# EAGLE design shield (EAGLE 6.6.0)
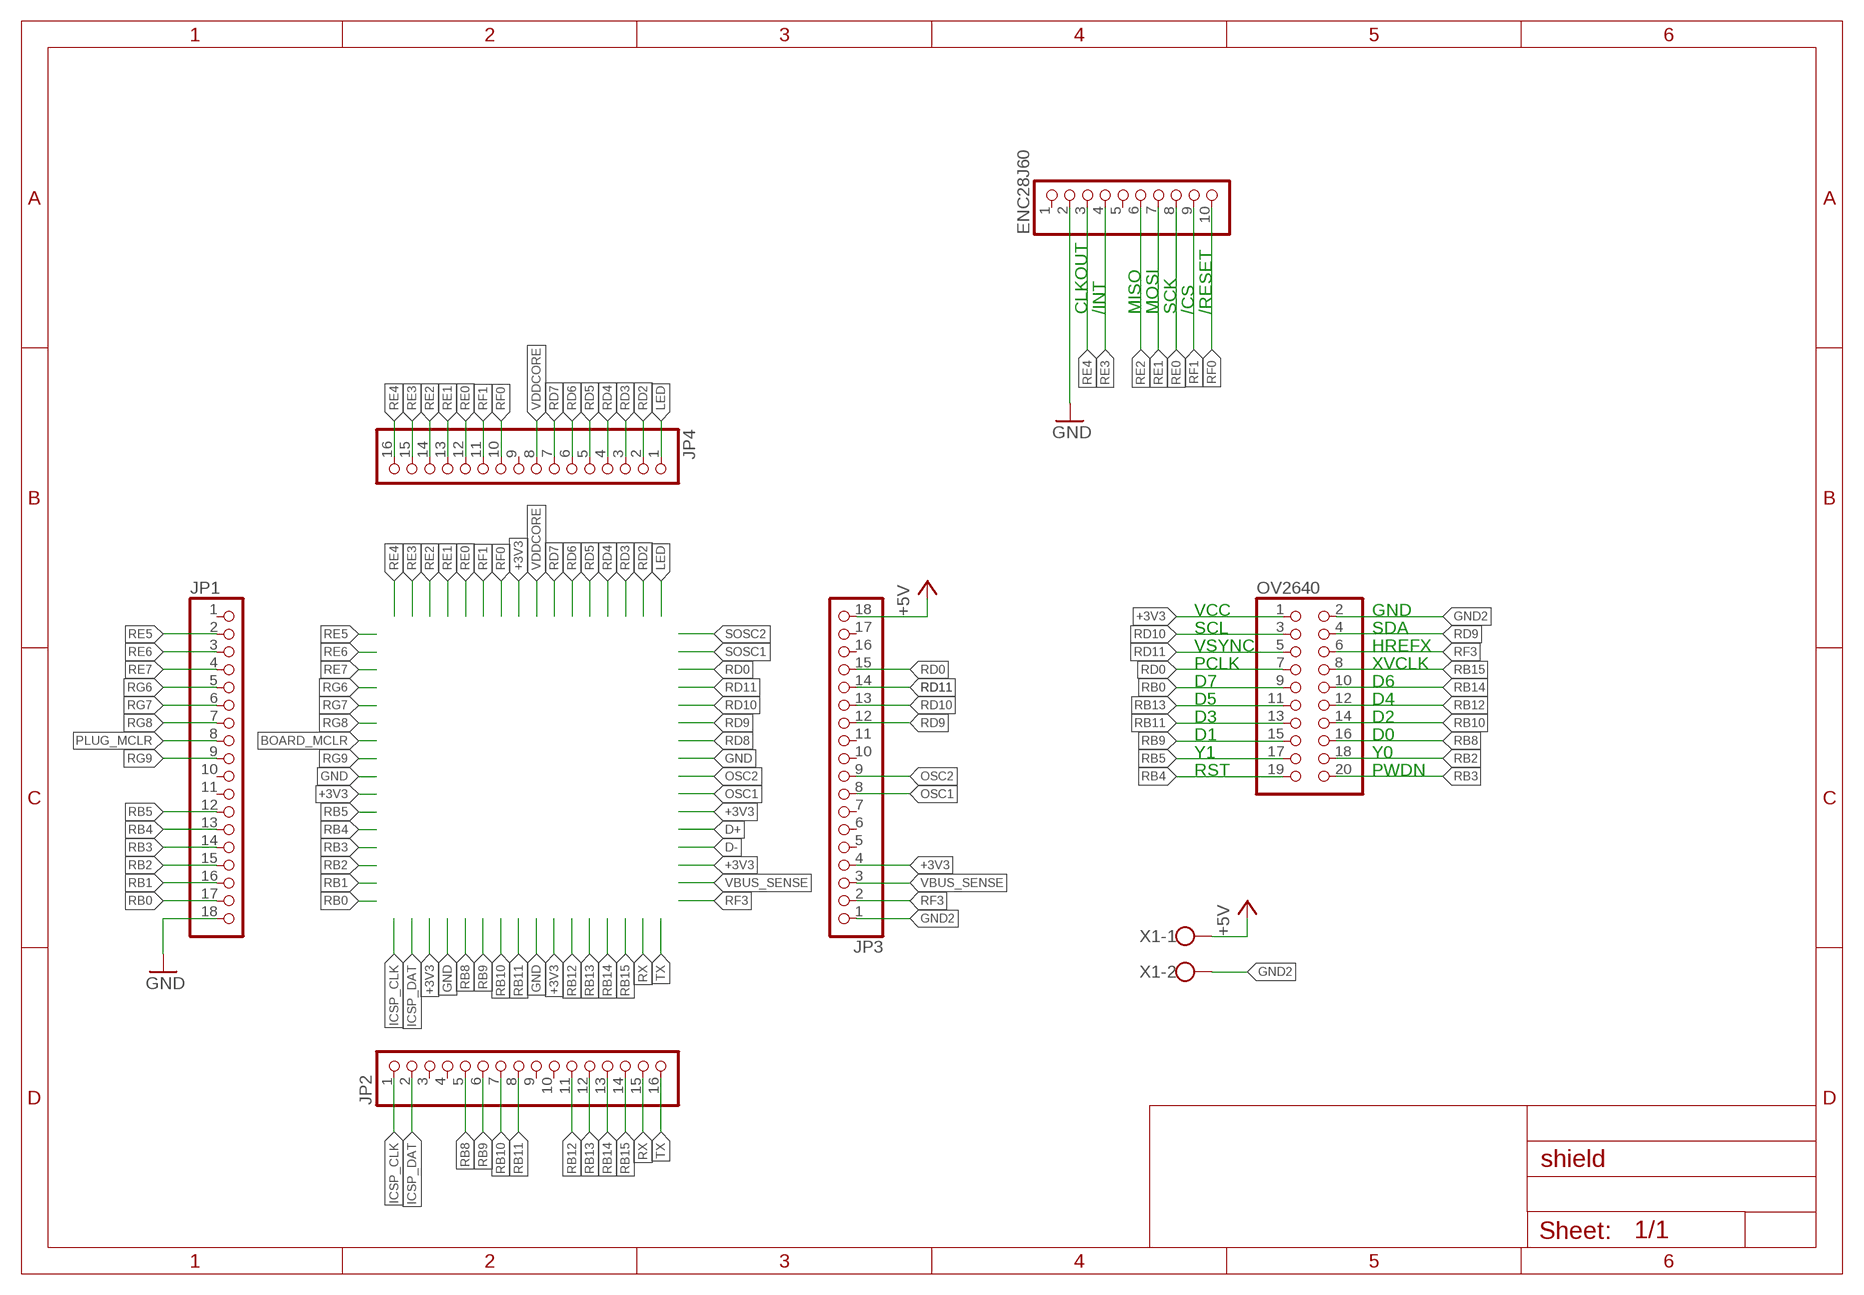
[diagram p0: schematic, sheet 1]

## Parts
ENC28J60  PINHD-1X10  [1X10]
JP1  PINHD-1X18/90  [1X18/90]
JP2  PINHD-1X16/90  [1X16/90]
JP3  PINHD-1X18/90  [1X18/90]
JP4  PINHD-1X16/90  [1X16/90]
OV2640  PINHD-2X10  [2X10]
X1  W237-102  [W237-102]

## Nets
+3V3: JP3.4 OV2640.1
+5V: JP3.18 X1.1
GND: ENC28J60.2 JP1.18
GND2: JP3.1 OV2640.2 X1.2
ICSP_CLK: JP2.1
ICSP_DAT: JP2.2
LED: JP4.1
N$1: JP3.3
OSC1: JP3.8
OSC2: JP3.9
PLUG_MCLR: JP1.8
RB0: JP1.17 OV2640.8
RB1: JP1.16
RB2: JP1.15 OV2640.18
RB3: JP1.14 OV2640.20
RB4: JP1.13 OV2640.19
RB5: JP1.12 OV2640.17
RB8: JP2.5 OV2640.16
RB9: JP2.6 OV2640.15
RB10: JP2.7 OV2640.14
RB11: JP2.8 OV2640.13
RB12: JP2.11 OV2640.12
RB13: JP2.12 OV2640.11
RB14: JP2.13 OV2640.10
RB15: JP2.14
RD0: JP3.15 OV2640.7
RD2: JP4.2
RD3: JP4.3
RD4: JP4.4
RD5: JP4.5
RD6: JP4.6
RD7: JP4.7
RD9: JP3.12 OV2640.4
RD10: JP3.13 OV2640.3
RD11: JP3.14 OV2640.5
RE0: ENC28J60.8 JP4.12
RE1: ENC28J60.7 JP4.13
RE2: ENC28J60.6 JP4.14
RE3: ENC28J60.4 JP4.15
RE4: ENC28J60.3 JP4.16
RE5: JP1.2
RE6: JP1.3
RE7: JP1.4
RF0: ENC28J60.10 JP4.10
RF1: ENC28J60.9 JP4.11
RF3: JP3.2 OV2640.6
RG6: JP1.5
RG7: JP1.6
RG8: JP1.7
RG9: JP1.9
RX: JP2.15
TX: JP2.16
VDDCORE: JP4.8
Unconnected: ENC28J60.1 ENC28J60.5 JP1.1 JP1.10 JP1.11 JP2.3 JP2.4 JP2.9 JP2.10 JP3.5 JP3.6 JP3.7 JP3.10 JP3.11 JP3.16 JP3.17 JP4.9 OV2640.9

## Notes on the sheet
- CLKOUT | /INT | MISO | MOSI | SCK | /CS | /RESET
- VCC | GND
- SCL | SDA
- VSYNC | HREFX
- PCLK | XVCLK
- D7 | D6
- D5 | D4
- D3 | D2
- D1 | D0
- Y1 | Y0
- RST | PWDN

## Library data of the parts
ENC28J60 = pinhead:PINHD-1X10: PIN HEADER
JP1 JP3 = custom:PINHD-1X18: PIN HEADER
JP2 JP4 = custom:PINHD-1X16: PIN HEADER
OV2640 = custom:PINHD-2X10: PIN HEADER
X1 = con-wago-500:W237-102: WAGO SCREW CLAMP; MPN: 237-102; OC_FARNELL: unknown; OC_NEWARK: 70K9898

## Board
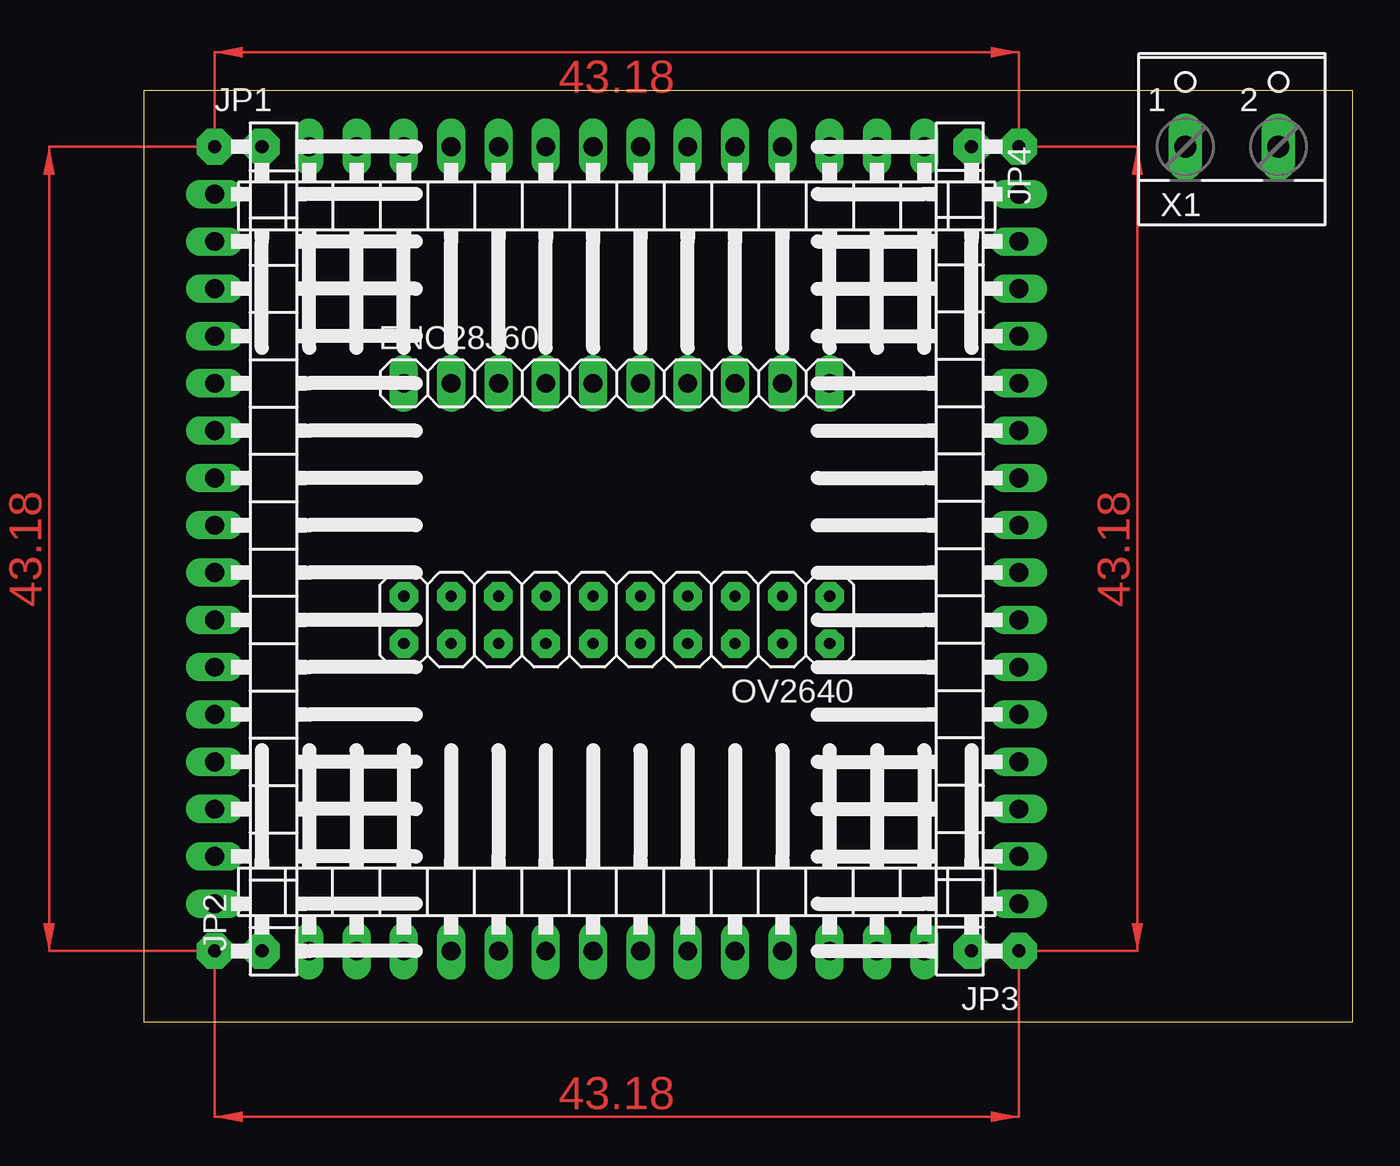
[diagram p1: board, top side]
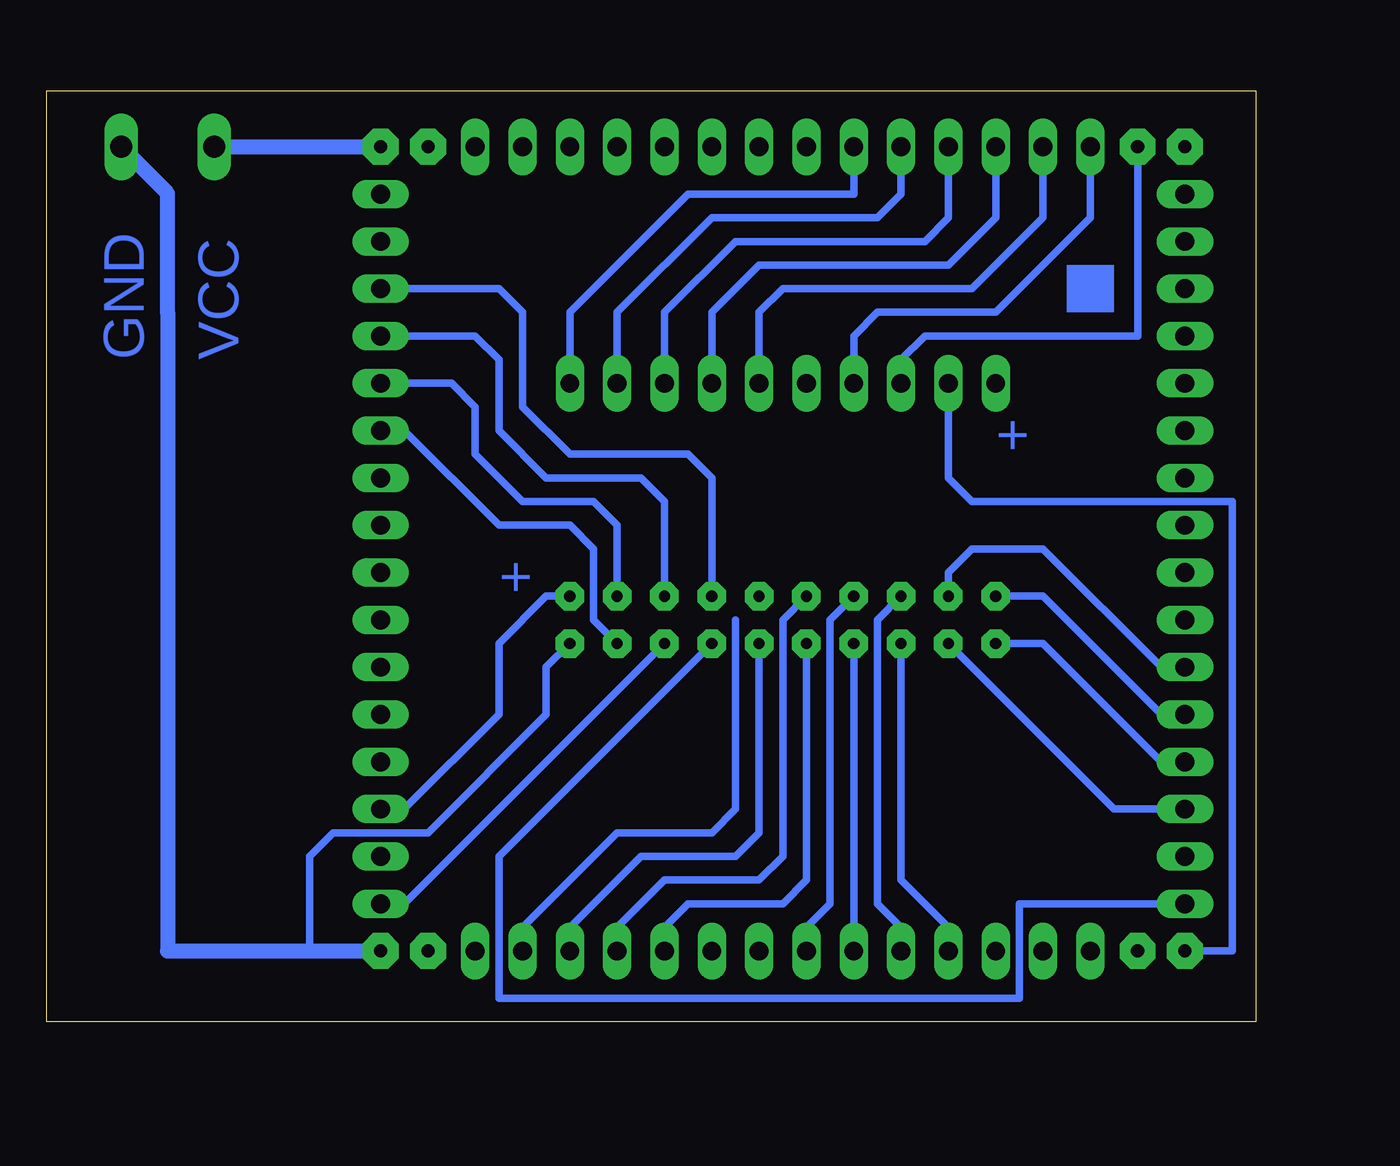
[diagram p2: board, bottom side, seen from below]

Size 64.92 x 50 mm. Coordinates in mm from the lower left corner, seen from the top.
Outline: 0,0 64.92,0 64.92,50 0,50 0,0
Copper layers (1*16): Top 0.035mm / dielectric 1.5mm / Bottom 0.035mm
Design rules "default *": minimum track width 16mil, minimum drill 24mil, track to track 8mil, track to pad 8mil, pad to pad 8mil, via to via 8mil, smd to smd 8mil, copper to edge 40mil, drill to drill 8mil, minimum pad ring 10mil, minimum via ring 8mil, stop-mask expansion 4mil, vias tented up to drill 0mil, thermal gap 10mil

### Footprints (pad centres in the part's own frame; a part is rotated, then mirrored left to right if it is on the bottom)
1X10 = drill 1.016 long: 1 -11.43,0; 2 -8.89,0; 3 -6.35,0; 4 -3.81,0; 5 -1.27,0; 6 1.27,0; 7 3.81,0; 8 6.35,0; 9 8.89,0; 10 11.43,0
1X18/90 = drill 0.7 pad 1.93 octagon: 1 -21.59,-3.81; 18 21.59,-3.81 | drill 1.016 long: 2 -19.05,-3.81; 3 -16.51,-3.81; 4 -13.97,-3.81; 5 -11.43,-3.81; 6 -8.89,-3.81; 7 -6.35,-3.81; 8 -3.81,-3.81; 9 -1.27,-3.81; 10 1.27,-3.81; 11 3.81,-3.81; 12 6.35,-3.81; 13 8.89,-3.81; 14 11.43,-3.81; 15 13.97,-3.81; 16 16.51,-3.81; 17 19.05,-3.81
1X16/90 = drill 0.7 pad 1.93 octagon: 1 -19.05,-3.81; 16 19.05,-3.81 | drill 1.016 long: 2 -16.51,-3.81; 3 -13.97,-3.81; 4 -11.43,-3.81; 5 -8.89,-3.81; 6 -6.35,-3.81; 7 -3.81,-3.81; 8 -1.27,-3.81; 9 1.27,-3.81; 10 3.81,-3.81; 11 6.35,-3.81; 12 8.89,-3.81; 13 11.43,-3.81; 14 13.97,-3.81; 15 16.51,-3.81
2X10 = drill 0.6 pad 1.524 octagon: 1 -11.43,-1.27; 2 -11.43,1.27; 3 -8.89,-1.27; 4 -8.89,1.27; 5 -6.35,-1.27; 6 -6.35,1.27; 7 -3.81,-1.27; 8 -3.81,1.27; 9 -1.27,-1.27; 10 -1.27,1.27; 11 1.27,-1.27; 12 1.27,1.27; 13 3.81,-1.27; 14 3.81,1.27; 15 6.35,-1.27; 16 6.35,1.27; 17 8.89,-1.27; 18 8.89,1.27; 19 11.43,-1.27; 20 11.43,1.27
W237-102 = drill 1.194 long: 1 -2.5,-1.27; 2 2.5,-1.27

### Placement (x,y rotation side)
ENC28J60  25.4,34.29 0 top
JP1  7.62,25.4 270 top
JP2  25.4,7.62 0 top
JP3  43.18,25.4 90 top
JP4  25.4,43.18 180 top
OV2640  25.4,21.59 180 top
X1  58.42,48.26 0 top

### Tracks (layer width: path | path; a pad name or v marks a point on that pad's centre or on a via)
+3V3
  Bottom 0.406: JP3.4 45.72,11.43 40.64,16.51 40.64,20.32 38.1,22.86 OV2640.1
+5V
  Bottom 0.813: X1.1 JP3.18
GND
  Bottom 0.406: JP1.18 1.27,3.81 1.27,27.94 15.24,27.94 16.51,29.21 ENC28J60.2 16.51,35.56
GND2
  Bottom 0.406: 50.8,3.81 50.8,8.89 49.53,10.16 44.45,10.16 38.1,16.51 38.1,19.05 OV2640.2
  Bottom 0.813: JP3.1 50.8,3.81 58.42,3.81 58.42,38.1 58.42,44.49 X1.2
RB0
  Bottom 0.406: JP1.17 12.7,6.35 12.7,1.27 40.64,1.27 40.64,8.89 OV2640.8
RB2
  Bottom 0.406: JP1.15 7.62,11.43 OV2640.18
RB3
  Bottom 0.406: JP1.14 5.08,13.97 11.43,20.32 OV2640.20
RB4
  Bottom 0.406: JP1.13 5.08,16.51 11.43,22.86 OV2640.19
RB5
  Bottom 0.406: JP1.12 5.08,19.05 11.43,25.4 15.24,25.4 16.51,24.13 OV2640.17
RB8
  Bottom 0.406: OV2640.16 19.05,7.62 16.51,5.08 JP2.5
RB9
  Bottom 0.406: OV2640.15 20.32,21.59 20.32,6.35 19.05,5.08 JP2.6
RB10
  Bottom 0.406: OV2640.14 JP2.7
RB11
  Bottom 0.406: OV2640.13 22.86,21.59 22.86,6.35 24.13,5.08 JP2.8
RB12
  Bottom 0.406: OV2640.12 24.13,7.62 25.4,6.35 30.48,6.35 31.75,5.08 JP2.11
RB13
  Bottom 0.406: OV2640.11 25.4,21.59 25.4,8.89 26.67,7.62 31.75,7.62 34.29,5.08 JP2.12
RB14
  Bottom 0.406: OV2640.10 26.67,10.16 27.94,8.89 33.02,8.89 36.83,5.08 JP2.13
RB15
  Bottom 0.406: 27.94,21.59 27.94,11.43 29.21,10.16 34.29,10.16 39.37,5.08 JP2.14
RD0
  Bottom 0.406: OV2640.7 29.21,29.21 30.48,30.48 36.83,30.48 39.37,33.02 39.37,38.1 40.64,39.37 JP3.15
RD9
  Bottom 0.406: OV2640.4 35.56,21.59 35.56,25.4 36.83,26.67 40.64,26.67 45.72,31.75 JP3.12
RD10
  Bottom 0.406: OV2640.3 34.29,26.67 35.56,27.94 39.37,27.94 41.91,30.48 41.91,33.02 43.18,34.29 JP3.13
RD11
  Bottom 0.406: JP3.14 41.91,36.83 40.64,35.56 40.64,31.75 38.1,29.21 33.02,29.21 31.75,27.94 OV2640.5
RE0
  Bottom 0.406: JP4.12 16.51,43.18 17.78,41.91 27.94,41.91 31.75,38.1 ENC28J60.8
RE1
  Bottom 0.406: JP4.13 13.97,43.18 16.51,40.64 26.67,40.64 29.21,38.1 ENC28J60.7
RE2
  Bottom 0.406: JP4.14 11.43,43.18 15.24,39.37 25.4,39.37 26.67,38.1 ENC28J60.6
RE3
  Bottom 0.406: JP4.15 8.89,43.18 13.97,38.1 20.32,38.1 21.59,36.83 ENC28J60.4
RE4
  Bottom 0.406: JP4.16 6.35,36.83 17.78,36.83 19.05,35.56 ENC28J60.3
RF0
  Bottom 0.406: JP4.10 21.59,44.45 30.48,44.45 36.83,38.1 ENC28J60.10
RF1
  Bottom 0.406: JP4.11 19.05,44.45 20.32,43.18 29.21,43.18 34.29,38.1 ENC28J60.9
RF3
  Bottom 0.406: OV2640.6 45.72,6.35 JP3.2
(copper drawn outside any net)
  shapes: Bottom area x1, Top area x4

### Text on the board
Bottom: VCC | GND | + | +